# Altium schematic sheet SeptinaryAI_Balldi__elec_plane__plane_2023-07-21.schdoc
size 258 x 168 mm
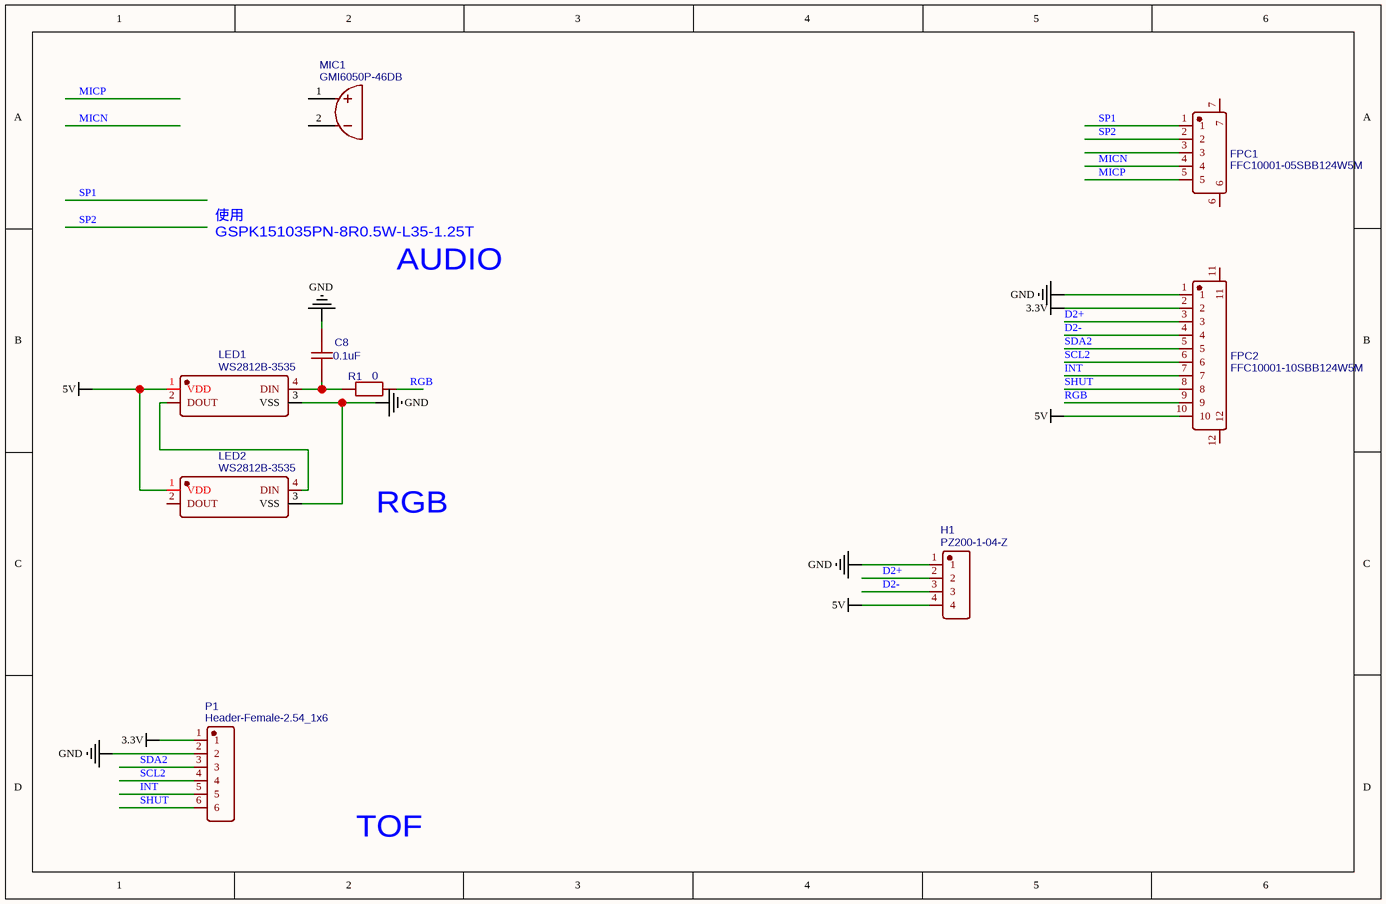
[diagram p0: SeptinaryAI_Balldi__elec_plane__plane_2023-07-21.schdoc]

## Parts
C8  0.1uF  [C0603]
FPC1  FFC10001-05SBB124W5M  [FFC-SMD_FFC10001-05SBB124W5M]
FPC2  FFC10001-10SBB124W5M  [FFC-SMD_FFC10001-10SBB124W5M]
H1  PZ200-1-04-Z  [HDR-TH_4P-P2.00-V-M]
LED1  WS2812B-3535  [LED-SMD_4P-L3.5-W3.5-TL_WS2812B]
LED2  WS2812B-3535  [LED-SMD_4P-L3.5-W3.5-TL_WS2812B]
MIC1  GMI6050P-46DB  [MIC-TH_BD6.0-P1.90-D0.4-L-RD]
P1  Header-Female-2.54_1x6  [HDR-TH_6P-P2.54-V-F]
R1  0  [R0603]

## Nets
3.3V: FPC2.2 P1.1
5V: FPC2.10 H1.4 LED1.1(VDD) LED2.1(VDD)
GND: C8.2 FPC2.1 H1.1 LED1.3(VSS) LED2.3(VSS) P1.2
D2+: FPC2.3 H1.2
D2-: FPC2.4 H1.3
INT: FPC2.7 P1.5
MICN: FPC1.4
MICP: FPC1.5
RGB: FPC2.9 R1.1
SCL2: FPC2.6 P1.4
SDA2: FPC2.5 P1.3
SHUT: FPC2.8 P1.6
SP1: FPC1.1
SP2: FPC1.2
NetC8_1: C8.1 LED1.4(DIN) R1.2
NetLED1_2: LED1.2(DOUT) LED2.4(DIN)

Not connected (* = marked no-connect by the designer): FPC1 3 6 7; FPC2 11 12; LED2 2(DOUT); MIC1 1(output) 2(GND)

## Notes on the sheet
- (near C8) 使用
  GSPK151035PN-8R0.5W-L35-1.25T
- AUDIO
- RGB
- TOF

## Library data of the parts
C8 = 0.1uF: BOM_Manufacturer: SAMSUNG(三星); BOM_Manufacturer Part: CL10F104ZO8NNNC; nameAlias: Capacitance; Contributor: LCSC; BOM_Supplier Part: C2762283; spicePre: C; spiceSymbolName: CL10F104ZO8NNNC
FPC1 = FFC10001-05SBB124W5M: BOM_Manufacturer: TXGA(特思嘉); Contributor: LCSC; BOM_Supplier Part: C2833987; BOM_Manufacturer Part: FFC10001-05SBB124W5M; spicePre: F; spiceSymbolName: FFC10001-05SBB124W5M
FPC2 = FFC10001-10SBB124W5M: BOM_Manufacturer: TXGA; Contributor: LCSC; BOM_Supplier Part: C456461; BOM_Manufacturer Part: FFC10001-10SBB124W5M; spicePre: F; spiceSymbolName: FFC10001-10SBB124W5M
H1 = PZ200-1-04-Z: BOM_Manufacturer: HCTL(华灿天禄); Contributor: LCSC; BOM_Supplier Part: C2905950; BOM_Manufacturer Part: PZ200-1-04-Z; spicePre: H; spiceSymbolName: PZ200-1-04-Z
LED1 LED2 = WS2812B-3535: BOM_Manufacturer: Worldsemi; Contributor: LCSC; BOM_Manufacturer Part: WS2812B-3535; BOM_Supplier Part: C114583; spicePre: L; spiceSymbolName: WS2812B-3535
MIC1 = GMI6050P-46DB: BOM_Manufacturer: INGHAi; Contributor: LCSC; BOM_Supplier Part: C233944; BOM_Manufacturer Part: GMI6050P-46db; spicePre: M; spiceSymbolName: GMI6050P-46DB
P1 = Header-Female-2.54_1x6: BOM_Manufacturer: BOOMELE; BOM_Manufacturer Part: Female header 1*6p; BOM_Supplier Part: C40877; spicePre: P; spiceSymbolName: Header-Female-2.54_1x6
R1 = 0: BOM_Manufacturer: VISHAY(威世); BOM_Manufacturer Part: TNPW0603130RBEEA; nameAlias: Resistance; Contributor: LCSC; BOM_Supplier Part: C1870287; spicePre: R; spiceSymbolName: TNPW0603130RBEEA